# EAGLE design esp01_flasher (EAGLE 9.2.0)
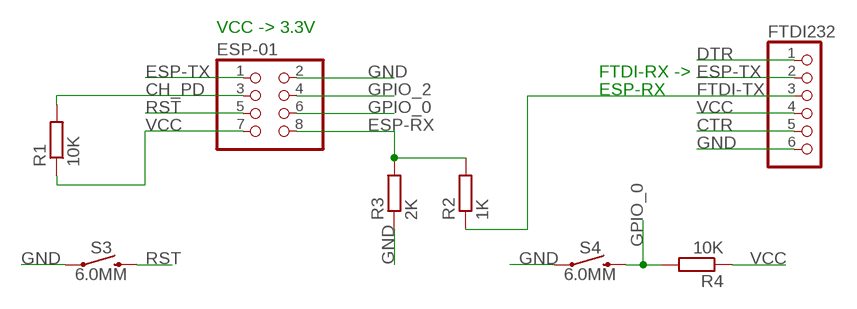
[diagram p0: schematic, sheet 1]

## Parts
ESP-01  PINHD-2X4  [2X04]
FTDI232  PINHD-1X6  [1X06]
R1  10K  RESISTOR-1206  [R1206]
R2  1K  RESISTOR-1206  [R1206]
R3  2K  RESISTOR-1206  [R1206]
R4  10K  RESISTOR-1206  [R1206]
S3  6.0MM  MOMENTARY-SWITCH-SPST-PTH-6.0MM  [TACTILE_SWITCH_PTH_6.0MM]
S4  6.0MM  MOMENTARY-SWITCH-SPST-PTH-6.0MM  [TACTILE_SWITCH_PTH_6.0MM]

## Nets
CH_PD: ESP-01.3 R1.2
CTR: FTDI232.5
DTR: FTDI232.1
ESP-RX: ESP-01.8 R2.2 R3.2
ESP-TX: ESP-01.1 FTDI232.2
FTDI-TX: FTDI232.3 R2.1
GND: ESP-01.2 FTDI232.6 R3.1 S3.1 S4.1
GPIO_0: ESP-01.6 R4.2 S4.3
GPIO_2: ESP-01.4
RST: ESP-01.5 S3.3
VCC: ESP-01.7 FTDI232.4 R1.1 R4.1

## Notes on the sheet
- VCC -> 3.3V
- FTDI-RX ->
- ESP-RX

## Library data of the parts
ESP-01 = adafruit:PINHD-2X4: PIN HEADER
FTDI232 = adafruit:PINHD-1X6: PIN HEADER
R1-R4 = dp_devices.v6:RESISTOR
S3 S4 = SparkFun-Switches:MOMENTARY-SWITCH-SPST: Momentary Switch (Pushbutton) - SPST Normally-open (NO) SPST momentary switches (buttons, pushbuttons). Variants PTH-12MM - 12mm square, through-hole Momentary Pushbutton Switch - 12mm Square <https://www.sparkfun.com/products/9190> (COM-09190) PTH-6.0MM, PTH-6.0MM-KIT - 6.0mm square, through-hole Mini Pushbutton Switch <https://www.sparkfun.com/products/97> (COM-00097) KIT package intended for soldering kit's - only one side of pads' copper is exposed. PTH-RIGHT-ANGLE-KIT - Right-angle, through-hole Right Angle Tactile Button <https://www.sparkfun.com/products/10791> - Used on SparkFun BigTime Watch Kit <https://www.sparkfun.com/products/11734> SMD-12MM - 12mm square, surface-mount Tactile Button - SMD (12mm) <https://www.sparkfun.com/products/12993> (COM-12993) Used on SparkFun PicoBoard <https://www.sparkfun.com/products/11888> SMD-4.5MM - 4.5mm Square Trackball Switch Used on SparkFun Blackberry Trackballer Breakout <https://www.sparkfun.com/products/13169> SMD-4.6MMX2.8MM - 4.60mm x 2.80mm, surface mount Used on SparkFun SAMD21 Mini Breakout <https://www.sparkfun.com/products/13664> SMD-5.2MM, SMD-5.2-REDUNDANT - 5.2mm square, surface-mount Mini Pushbutton Switch - SMD <https://www.sparkfun.com/products/8720> (COM-08720) Used on Arduino Pro Mini <https://www.sparkfun.com/products/11114> REDUNDANT package connects both switch circuits together SMD-6.0X3.5MM - 6.0 x 3.5mm, surface mount Momentary Reset Switch SMD <https://www.sparkfun.com/products/8229> (COM-08229) SMD-6.2MM-TALL - 6.2mm square, surface mount Tactile Button - SMD (6mm) <https://www.sparkfun.com/products/12992> Used on SparkFun Digital Sandbox <https://www.sparkfun.com/products/12651> SMD-RIGHT-ANGLE - Right-angle, surface mount Used on SparkFun Block for Intel® Edison - Arduino <https://www.sparkfun.com/products/13036>; PROD_ID: SWCH-08441; SF_SKU: COM-00097

## Board
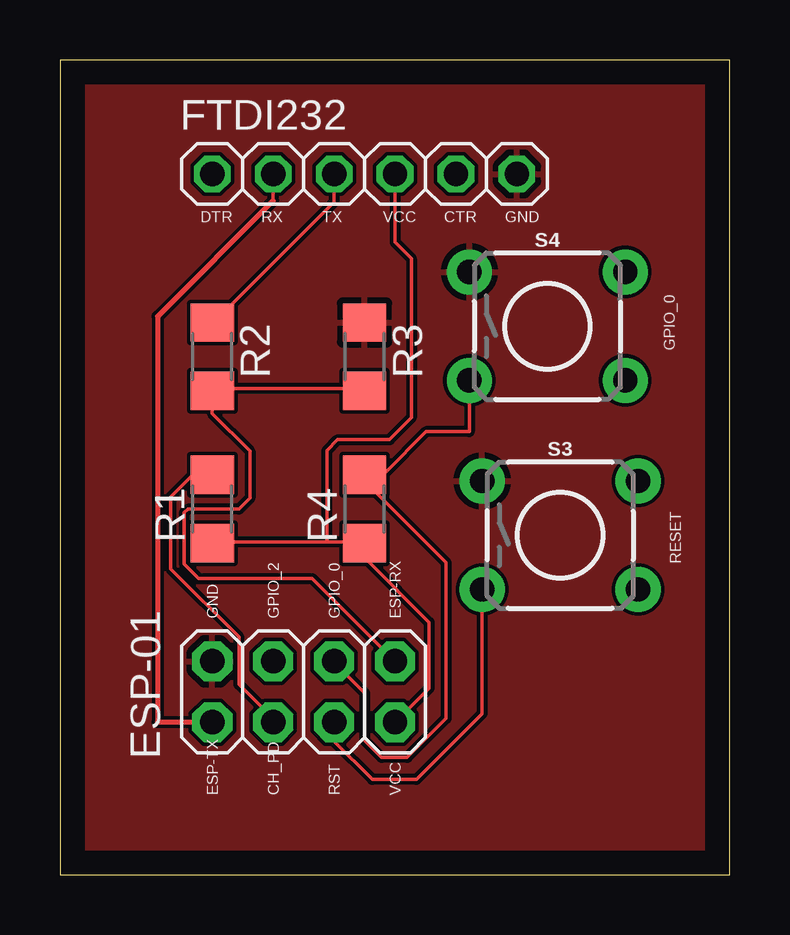
[diagram p1: board, top side]

Size 27.92 x 33.96 mm. Coordinates in mm from the lower left corner, seen from the top.
Outline: 0,0 27.92,0 27.92,33.96 0,33.96 0,0
Copper layers (1*16): Top 0.035mm / dielectric 1.5mm / Bottom 0.035mm
Design rules "default *": minimum track width 6mil, minimum drill 0.35mm, track to track 6mil, track to pad 6mil, pad to pad 6mil, via to via 6mil, smd to smd 6mil, copper to edge 40mil, drill to drill 6mil, minimum pad ring 10mil, minimum via ring 8mil, stop-mask expansion 4mil, vias tented up to drill 0mil, thermal gap 10mil

### Footprints (pad centres in the part's own frame; a part is rotated, then mirrored left to right if it is on the bottom)
2X04 = drill 1.016 pad 1.676 octagon: 1 -3.81,-1.27; 2 -3.81,1.27; 3 -1.27,-1.27; 4 -1.27,1.27; 5 1.27,-1.27; 6 1.27,1.27; 7 3.81,-1.27; 8 3.81,1.27
1X06 = drill 1.016 octagon: 1 -6.35,0; 2 -3.81,0; 3 -1.27,0; 4 1.27,0; 5 3.81,0; 6 6.35,0
R1206 = smd 1.6 x 1.803: 1 -1.422,0; 2 1.422,0
TACTILE_SWITCH_PTH_6.0MM = drill 1.016 pad 1.88: 1 -3.251,2.261; 2 3.251,2.261; 3 -3.251,-2.261; 4 3.251,-2.261

### Placement (x,y rotation side)
ESP-01  10.16,7.62 0 top
FTDI232  12.7,29.21 0 top
R1  6.35,15.24 90 top
R2  6.35,21.59 270 top
R3  12.7,21.59 270 top
R4  12.7,15.24 90 top
S3  20.85,14.15 0 top
S4  20.32,22.86 0 top

### Tracks (layer width: path | path; a pad name or v marks a point on that pad's centre or on a via)
CH_PD
  Top 0.152: R1.2 6.25,16.61 5.49,16.61 4.62,15.75 4.62,12.75 7.47,9.91 7.47,7.92 8.88,6.51 8.89,6.51 ESP-01.3
ESP-RX
  Top 0.152: 6.86,20.27 12.65,20.27 R3.2 | 6.86,20.27 6.4,20.27 R2.2 | ESP-01.8 10.52,12.34 5.79,12.34 5.18,12.95 5.18,15.09 5.33,15.24 7.47,15.24 7.92,15.7 7.92,17.65 6.35,19.23 R2.2 | 6.86,20.27 R2.2
ESP-TX
  Top 0.152: FTDI232.2 8.89,28.09
  Top 0.203: ESP-01.1 4.06,6.35 4.06,23.27 8.89,28.09
FTDI-TX
  Top 0.152: R2.1 6.4,23.01 11.43,28.04 FTDI232.3
GND
  pour Top: -1.27,34.29 29.21,34.29 29.21,-1.27 -1.27,-1.27
GPIO_0
  Top 0.152: 13.16,16.76 12.8,16.76 R4.2 13.26,16.76 | 13.16,16.76 13.26,16.76 | 13.26,16.76 13.56,16.76 15.26,18.46 17.07,18.46 S4.3 | 13.16,16.76 13.16,15.95 16.1,13.01 16.1,6.5 14.48,4.88 13.41,4.88 12.7,5.59 12.7,7.57 11.43,8.84 ESP-01.6
RST
  Top 0.152: ESP-01.5 11.43,5.56 13.03,3.96 14.86,3.96 17.6,6.71 S3.3
VCC
  Top 0.152: 11.12,13.87 12.65,13.87 R4.1 12.8,13.72 12.8,13.11 15.39,10.52 15.39,7.77 ESP-01.7 | 11.12,13.87 6.4,13.87 R1.1 | FTDI232.4 13.97,26.36 14.66,25.68 14.66,19.05 13.74,18.14 11.58,18.14 11.12,17.68 11.12,13.87

### Text on the board
tNames: DTR | RX | TX | VCC | CTR | GND | GPIO_0 | RESET | GND | GPIO_2 | GPIO_0 | ESP-RX | ESP-TX | CH_PD | RST | VCC